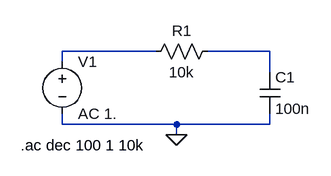
[diagram p0: schematic Condensador en AC.asc]
Condensador en AC.asc, the LTspice schematic file:
Version 4
SHEET 1 880 680
WIRE 128 112 -16 112
WIRE 304 112 208 112
WIRE -16 128 -16 112
WIRE 304 144 304 112
WIRE -16 224 -16 208
WIRE 160 224 -16 224
WIRE 304 224 304 208
WIRE 304 224 160 224
WIRE 160 240 160 224
FLAG 160 240 0
SYMBOL cap 288 144 R0
SYMATTR InstName C1
SYMATTR Value 100n
SYMBOL res 224 96 R90
WINDOW 0 0 56 VBottom 2
WINDOW 3 32 56 VTop 2
SYMATTR InstName R1
SYMATTR Value 10k
SYMBOL voltage -16 112 R0
WINDOW 123 0 0 Left 0
WINDOW 39 0 0 Left 0
SYMATTR InstName V1
SYMATTR Value AC 1.
TEXT -80 256 Left 2 !.ac dec 100 1 10k

The netlist it stands for:
* Condensador en AC.asc
C1 N002 0 100n
R1 N002 N001 10k
V1 N001 0 AC 1.
.ac dec 100 1 10k
.backanno
.end